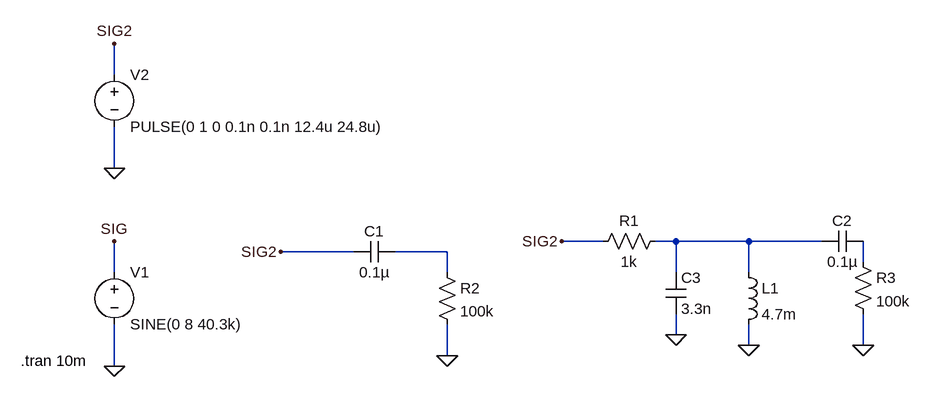
[diagram p0: schematic pulse.asc]
pulse.asc, the LTspice schematic file:
Version 4
SHEET 1 2276 980
WIRE 112 -176 112 -224
WIRE 112 -32 112 -96
WIRE 864 80 800 80
WIRE 976 80 944 80
WIRE 1088 80 976 80
WIRE 1200 80 1088 80
WIRE 480 96 368 96
WIRE 624 96 544 96
WIRE 1264 112 1264 80
WIRE 112 128 112 80
WIRE 624 128 624 96
WIRE 976 128 976 80
WIRE 1088 128 1088 80
WIRE 976 224 976 192
WIRE 1088 240 1088 208
WIRE 1264 240 1264 192
WIRE 624 256 624 208
WIRE 112 272 112 208
FLAG 112 272 0
FLAG 112 80 SIG
FLAG 368 96 SIG2
FLAG 112 -32 0
FLAG 112 -224 SIG2
FLAG 624 256 0
FLAG 800 80 SIG2
FLAG 1264 240 0
FLAG 976 224 0
FLAG 1088 240 0
SYMBOL voltage 112 112 R0
WINDOW 123 0 0 Left 0
WINDOW 39 0 0 Left 0
SYMATTR InstName V1
SYMATTR Value SINE(0 8 40.3k)
SYMBOL voltage 112 -192 R0
WINDOW 123 0 0 Left 0
WINDOW 39 0 0 Left 0
SYMATTR InstName V2
SYMATTR Value PULSE(0 1 0 0.1n 0.1n 12.4u 24.8u)
SYMBOL cap 544 80 R90
WINDOW 0 0 32 VBottom 2
WINDOW 3 32 32 VTop 2
SYMATTR InstName C1
SYMATTR Value 0.1µ
SYMBOL res 608 112 R0
SYMATTR InstName R2
SYMATTR Value 100k
SYMBOL cap 1264 64 R90
WINDOW 0 0 32 VBottom 2
WINDOW 3 32 32 VTop 2
SYMATTR InstName C2
SYMATTR Value 0.1µ
SYMBOL res 1248 96 R0
SYMATTR InstName R3
SYMATTR Value 100k
SYMBOL res 960 64 R90
WINDOW 0 0 56 VBottom 2
WINDOW 3 32 56 VTop 2
SYMATTR InstName R1
SYMATTR Value 1k
SYMBOL cap 960 128 R0
SYMATTR InstName C3
SYMATTR Value 3.3n
SYMBOL ind 1072 112 R0
SYMATTR InstName L1
SYMATTR Value 4.7m
TEXT -32 264 Left 2 !.tran 10m

The netlist it stands for:
* pulse.asc
V1 SIG 0 SINE(0 8 40.3k)
V2 SIG2 0 PULSE(0 1 0 0.1n 0.1n 12.4u 24.8u)
C1 N002 SIG2 0.1µ
R2 N002 0 100k
C2 N003 N001 0.1µ
R3 N003 0 100k
R1 N001 SIG2 1k
C3 N001 0 3.3n
L1 N001 0 4.7m
.tran 10m
.backanno
.end